# EAGLE schematic 426-300-001 Main Power Enclosure (EAGLE 6.5.0)

## Sheet 1 of 2
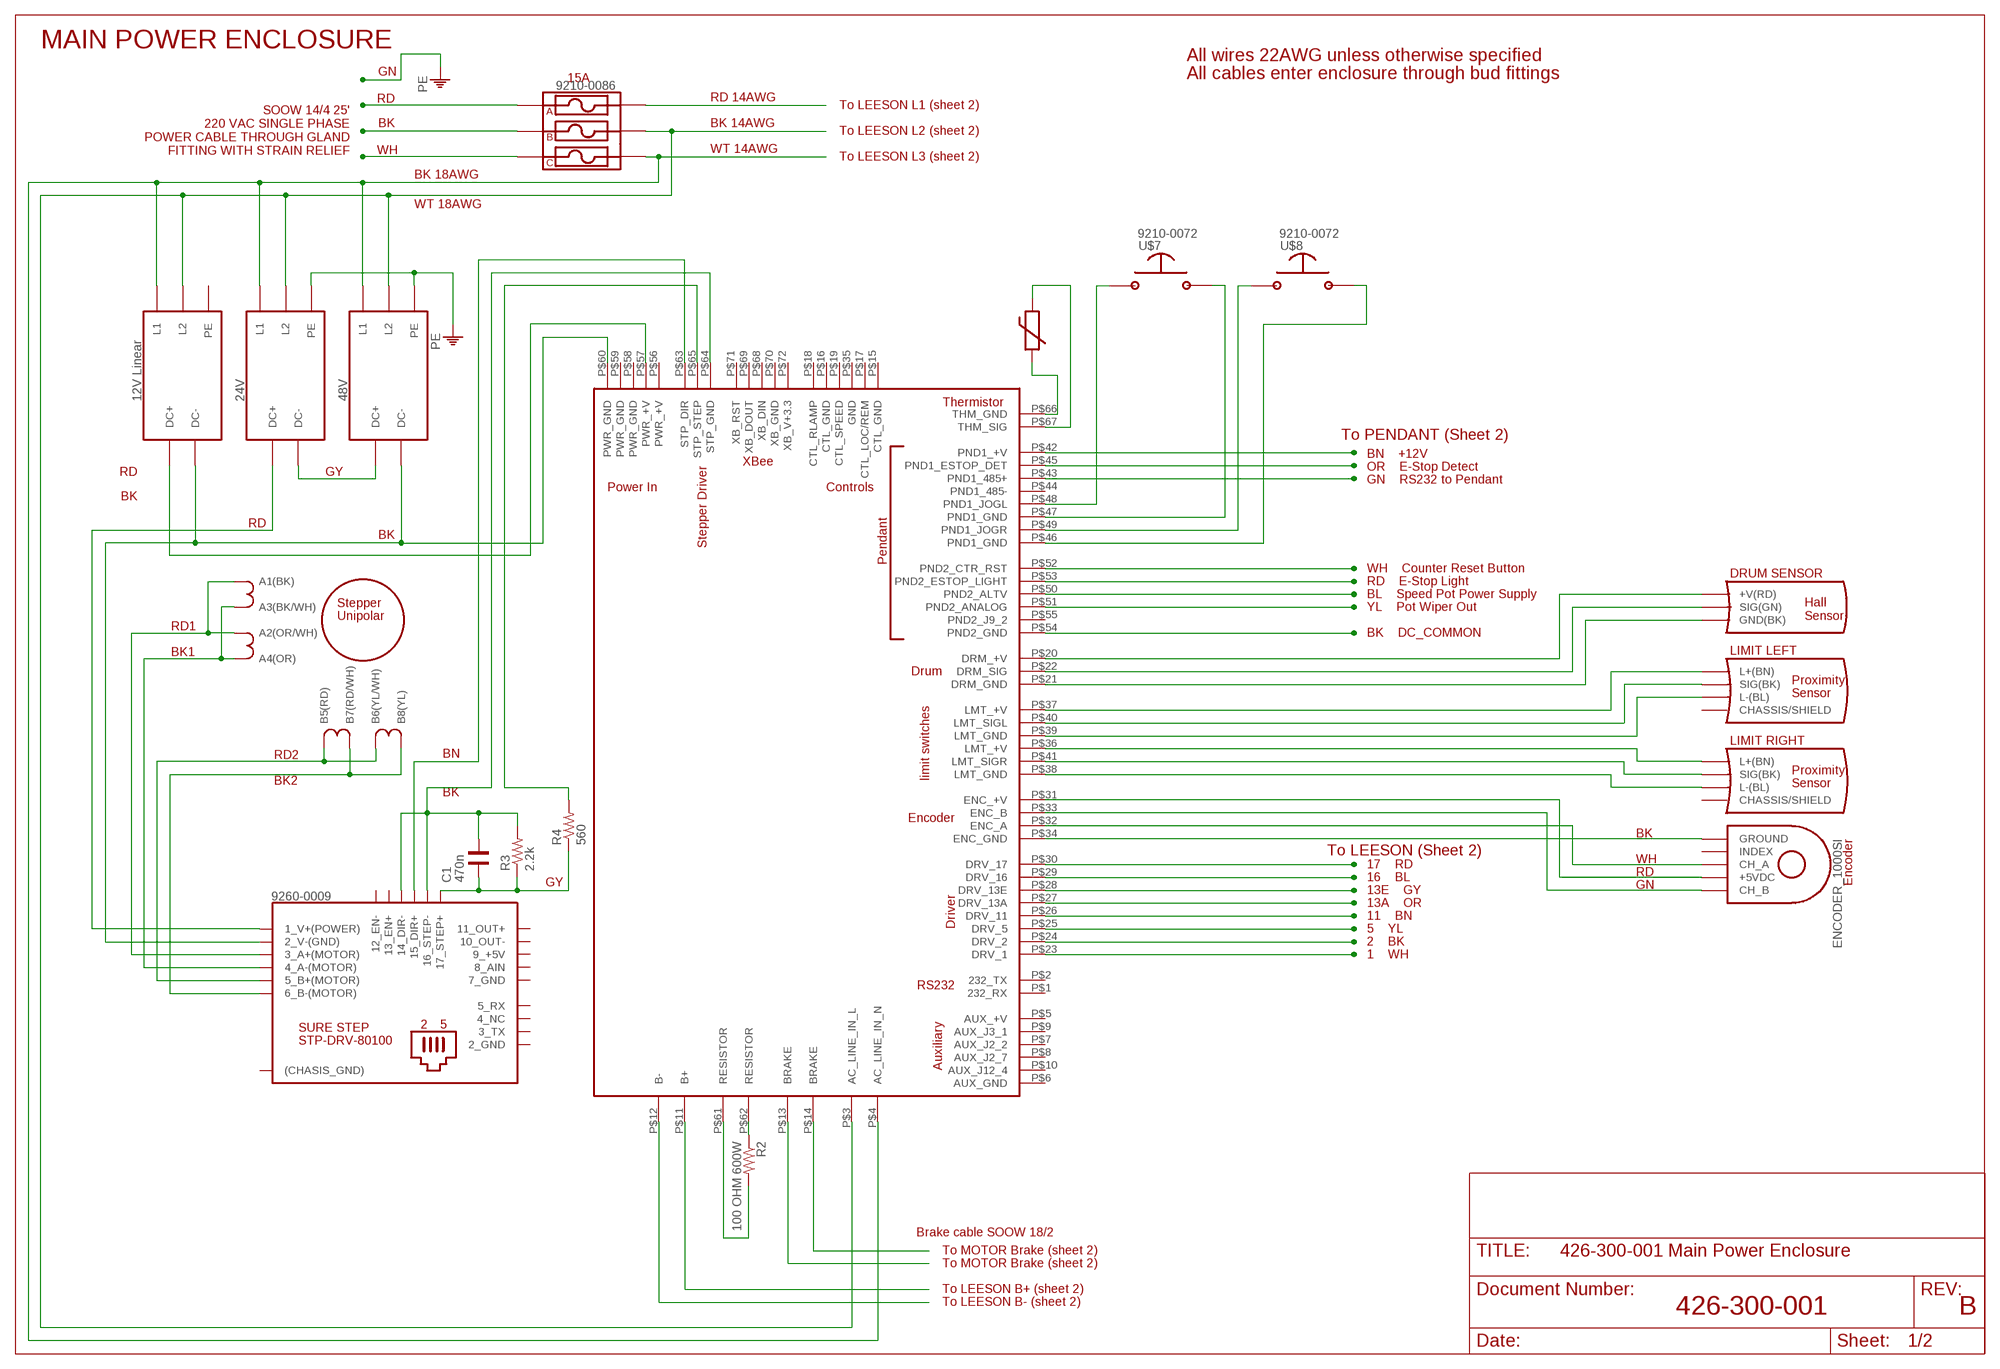
[diagram p0: schematic, sheet 1]

### Parts
C1  470n  C0805  [C0805]
R2  100 OHM 600W  RESISTORKIT  [AXIAL-0.3-KIT]
R3  2.2k  RESISTOR0805-RES  [0805]
R4  560  RESISTOR0805-RES  [0805]
U$2  THERMISTOR  [BOGUS]
U$3  SENSOR_HALL  [BOGUS@1]
U$4  ENCODER_1000SI  [BOGUS]
U$6  SENSOR_PROXIMITY  [BOGUS]
U$7  SWITCH_MOM_NO  [BOGUS]
U$8  SWITCH_MOM_NO  [BOGUS]
U$9  SENSOR_PROXIMITY  [BOGUS]
U$10  24V  POWER_SUPPLY  [BOGUS]
U$11  FUSE_HOLDER_3-POLE  [BOGUS]
U$12  48V  POWER_SUPPLY  [BOGUS]
U$13  MOTOR_STEPPER_UNIPOLAR  [BOGUS]
U$14  SURE_STEP_STP-DRV-80100  [BOGUS]
U$18  12V Linear  POWER_SUPPLY  [BOGUS]
U$19  SOSI_CONTROLLER_ECO_0.3  [BOGUS]

### Nets
N$1: U$11.P$3
N$2: U$9.P$3(L-(BL)) U$19.P$38(LMT_GND)
N$3: U$11.P$2
N$4: U$11.P$1
N$5: U$19.P$42(PND1_+V)
N$6: U$9.P$4(SIG(BK)) U$19.P$41(LMT_SIGR)
N$7: U$9.P$2(L+(BN)) U$19.P$36(LMT_+V)
N$8: U$19.P$45(PND1_ESTOP_DET)
N$9: U$7.P$1 U$19.P$48(PND1_JOGL)
N$10: U$7.P$2 U$19.P$47(PND1_GND)
N$11: U$8.P$1 U$19.P$49(PND1_JOGR)
N$12: U$6.P$2(L+(BN)) U$19.P$37(LMT_+V)
N$13: U$6.P$4(SIG(BK)) U$19.P$40(LMT_SIGL)
N$14: U$6.P$3(L-(BL)) U$19.P$39(LMT_GND)
N$15: U$8.P$2 U$19.P$46(PND1_GND)
N$16: U$10.P$4(L2) U$11.P$4 U$12.P$4(L2) U$18.P$4(L2) U$19.P$3(AC_LINE_IN_L)
N$17: U$19.P$52(PND2_CTR_RST)
N$18: R2.P$2 U$19.P$61(RESISTOR)
N$19: U$19.P$53(PND2_ESTOP_LIGHT)
N$20: U$2.P$1 U$19.P$66(THM_GND)
N$21: U$19.P$50(PND2_ALTV)
N$22: U$19.P$51(PND2_ANALOG)
N$23: U$19.P$54(PND2_GND)
N$24: U$10.P$3(L1) U$11.P$6 U$12.P$3(L1) U$18.P$3(L1) U$19.P$4(AC_LINE_IN_N)
N$25: U$19.P$43(PND1_485+)
N$26: U$19.P$23(DRV_1)
N$27: U$19.P$30(DRV_17)
N$32: U$19.P$24(DRV_2)
N$34: U$3.P$1(+V(RD)) U$19.P$20(DRM_+V)
N$35: U$3.P$3(SIG(GN)) U$19.P$22(DRM_SIG)
N$36: R2.P$1
N$37: U$3.P$2(GND(BK)) U$19.P$21(DRM_GND)
N$38: U$19.P$25(DRV_5)
N$39: U$2.P$2 U$19.P$67(THM_SIG)
N$40: U$4.P$1(+5VDC) U$19.P$31(ENC_+V)
N$41: U$4.P$3(CH_B) U$19.P$33(ENC_B)
N$42: U$4.P$2(CH_A) U$19.P$32(ENC_A)
N$43: U$4.P$4(GROUND) U$19.P$34(ENC_GND)
N$44: U$19.P$26(DRV_11)
N$46: U$19.P$27(DRV_13A)
N$48: U$19.P$28(DRV_13E)
N$49: U$19.P$29(DRV_16)
N$53: U$11.P$5
N$54: U$18.P$1(DC+) U$19.P$57(PWR_+V)
N$55: U$12.P$2(DC-) U$14.P$3(2_V-(GND)) U$18.P$2(DC-) U$19.P$60(PWR_GND)
N$59: C1.2 R3.2 U$14.P$15(14_DIR-) U$14.P$17(16_STEP-) U$19.P$64(STP_GND)
N$60: C1.1 R3.1 R4.1 U$14.P$18(17_STEP+)
N$61: U$14.P$16(15_DIR+) U$19.P$63(STP_DIR)
N$64: U$13.P$3(A3(BK/WH)) U$13.P$4(A4(OR)) U$14.P$5(4_A-(MOTOR))
N$65: U$13.P$1(A1(BK)) U$13.P$2(A2(OR/WH)) U$14.P$4(3_A+(MOTOR))
N$66: U$10.P$1(DC+) U$14.P$2(1_V+(POWER))
N$68: U$10.P$2(DC-) U$12.P$1(DC+)
N$69: U$13.P$5(B5(RD)) U$13.P$6(B6(YL/WH)) U$14.P$6(5_B+(MOTOR))
N$70: U$13.P$7(B7(RD/WH)) U$13.P$8(B8(YL)) U$14.P$7(6_B-(MOTOR))
N$76: R4.2 U$19.P$65(STP_STEP)
N$95: U$19.P$12(B-)
N$96: U$19.P$11(B+)
N$97: U$19.P$13(BRAKE)
N$98: U$19.P$14(BRAKE)
PE: U$10.P$5(PE) U$12.P$5(PE) ; also sheet 2
Unconnected: U$4.P$5(INDEX) U$6.P$1(CHASSIS/SHIELD) U$9.P$1(CHASSIS/SHIELD) U$18.P$5(PE) U$19.P$1(232_RX) U$19.P$2(232_TX) U$19.P$5(AUX_+V) U$19.P$6(AUX_GND) U$19.P$7(AUX_J2_2) U$19.P$8(AUX_J2_7) U$19.P$9(AUX_J3_1) U$19.P$10(AUX_J12_4) U$19.P$15(CTL_GND) U$19.P$16(CTL_GND) U$19.P$17(CTL_LOC/REM) U$19.P$18(CTL_RLAMP) U$19.P$19(CTL_SPEED) U$19.P$35(GND) U$19.P$44(PND1_485-) U$19.P$55(PND2_J9_2) U$19.P$56(PWR_+V) U$19.P$58(PWR_GND) U$19.P$59(PWR_GND) U$19.P$62(RESISTOR) U$19.P$68(XB_DIN) U$19.P$69(XB_DOUT) U$19.P$70(XB_GND) U$19.P$71(XB_RST) U$19.P$72(XB_V+3.3)

### Notes on the sheet
- MAIN POWER ENCLOSURE
- All wires 22AWG unless otherwise specified
- GN
- 15A | All cables enter enclosure through bud fittings
- RD | RD 14AWG
- SOOW 14/4 25'
  220 VAC SINGLE PHASE
  POWER CABLE THROUGH GLAND
  FITTING WITH STRAIN RELIEF
- To LEESON L1 (sheet 2)
- BK | BK 14AWG
- To LEESON L2 (sheet 2)
- WH | WT 14AWG
- To LEESON L3 (sheet 2)
- BK 18AWG
- WT 18AWG
- To PENDANT (Sheet 2)
- BN    +12V
- OR    E-Stop Detect
- RD | GY
- GN    RS232 to Pendant
- BK
- RD
- BK
- WH    Counter Reset Button
- DRUM SENSOR
- RD    E-Stop Light
- BL    Speed Pot Power Supply
- YL    Pot Wiper Out
- RD1
- BK    DC_COMMON
- BK1 | LIMIT LEFT
- LIMIT RIGHT
- RD2 | BN
- BK2
- BK
- BK
- To LEESON (Sheet 2)
- WH
- 17    RD
- RD
- 16    BL
- GY | GN
- 13E    GY
- 13A    OR
- 11    BN
- 5    YL
- 2    BK
- 1    WH
- Brake cable SOOW 18/2
- To MOTOR Brake (sheet 2)
- To MOTOR Brake (sheet 2)
- To LEESON B+ (sheet 2)
- To LEESON B- (sheet 2)
- 426-300-001 | B

## Sheet 2 of 2
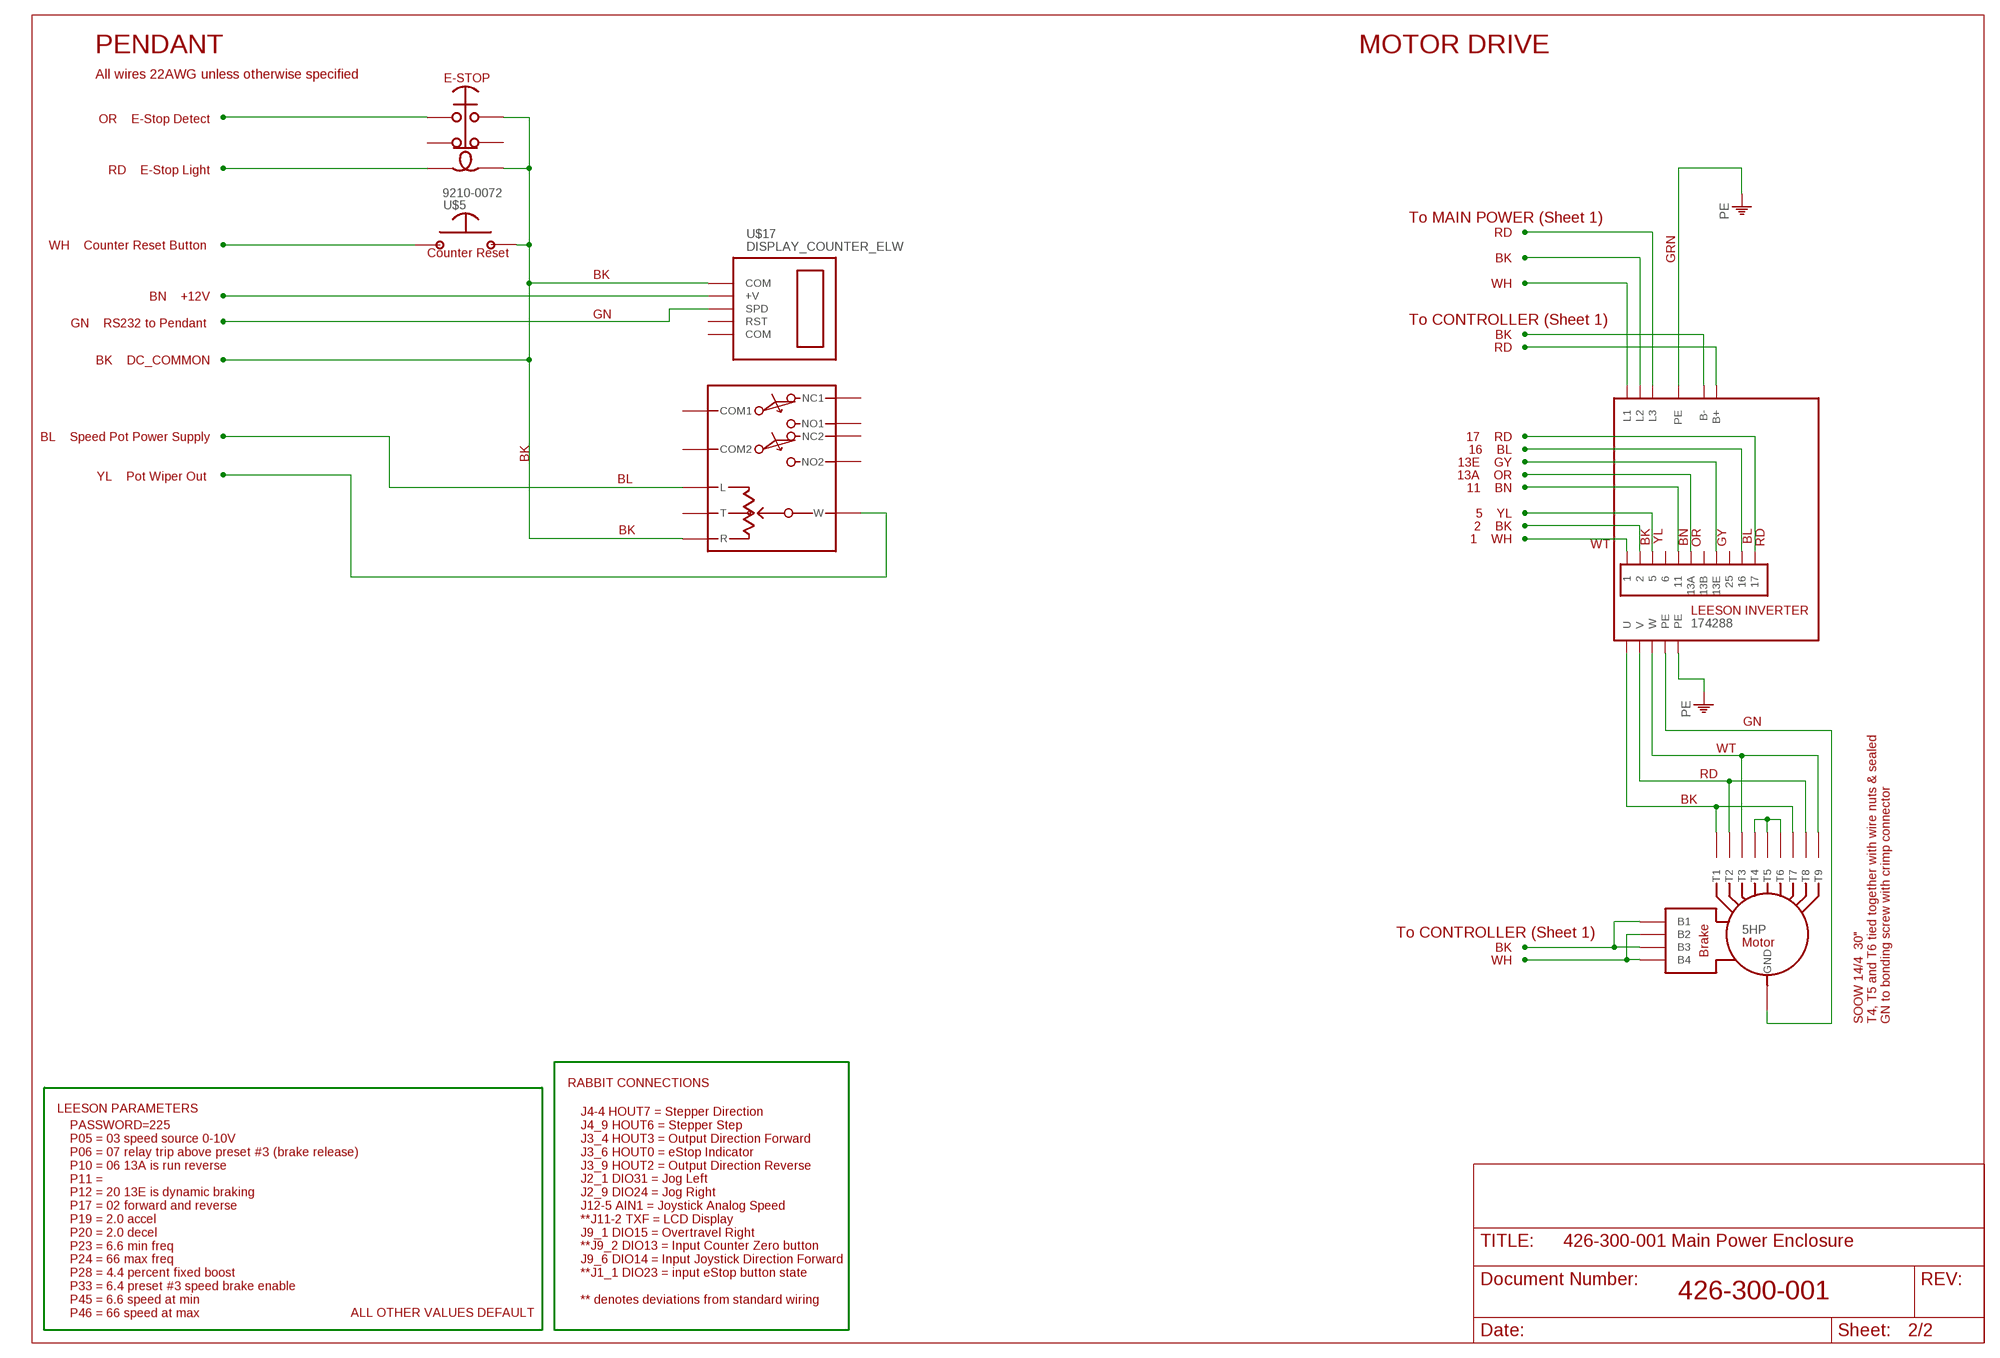
[diagram p1: schematic, sheet 2]

### Parts
U$1  5HP  MOTOR_3PH  [BOGUS]
U$5  Counter Reset  SWITCH_MOM_NO  [BOGUS]
U$15  SWITCH_ESTOP_LIGHTED  [BOGUS]
U$16  JOYSTICK_PRO-5  [BOGUS]
U$17  DISPLAY_COUNTER_ELW  [BOGUS]
U$24  174288  INVERTER_LEESON_3-PHASE  [BOGUS@2]

### Nets
N$28: U$17.P$5(SPD)
N$29: U$5.P$1
N$30: U$15.P$1
N$31: U$16.P$3(L)
N$33: U$5.P$2 U$15.P$3 U$15.P$6 U$16.P$8(R) U$17.P$2(COM)
N$45: U$24.P$14(L1)
N$47: U$1.P$8(T4) U$1.P$9(T5) U$1.P$10(T6)
N$58: U$1.P$5(T1) U$1.P$11(T7) U$24.P$20(U)
N$63: U$15.P$5
N$71: U$1.P$6(T2) U$1.P$12(T8) U$24.P$21(V)
N$72: U$1.P$7(T3) U$1.P$13(T9) U$24.P$22(W)
N$73: U$16.P$10(W)
N$74: U$1.P$14(GND) U$24.P$18(PE)
N$75: U$17.P$1(+V)
N$77: U$1.P$2(B2) U$1.P$4(B4)
N$80: U$24.P$15(L2)
N$81: U$24.P$1
N$82: U$1.P$1(B1) U$1.P$3(B3)
N$83: U$24.P$2
N$84: U$24.P$3
N$85: U$24.P$5
N$86: U$24.P$6(13A)
N$87: U$24.P$16(L3)
N$88: U$24.P$13(B-)
N$89: U$24.P$12(B+)
N$90: U$24.P$9
N$91: U$24.P$8(13E)
N$92: U$24.P$10
PE: U$24.P$17(PE) U$24.P$19(PE) ; also sheet 1
Unconnected: U$15.P$2 U$15.P$4 U$16.P$1(COM1) U$16.P$2(COM2) U$16.P$4(NC1) U$16.P$5(NC2) U$16.P$6(NO1) U$16.P$7(NO2) U$16.P$9(T) U$17.P$3(COM) U$17.P$4(RST) U$24.P$4 U$24.P$7(13B) U$24.P$11

### Notes on the sheet
- PENDANT | MOTOR DRIVE
- All wires 22AWG unless otherwise specified
- OR    E-Stop Detect
- RD    E-Stop Light
- To MAIN POWER (Sheet 1)
- RD
- WH    Counter Reset Button
- BK
- Counter Reset
- GRN
- BK | WH
- BN    +12V
- GN    RS232 to Pendant | GN
- To CONTROLLER (Sheet 1)
- BK
- RD
- BK    DC_COMMON
- BL    Speed Pot Power Supply | 17    RD
- 16    BL
- 13E    GY
- BK
- YL    Pot Wiper Out | 13A    OR
- BL | 11    BN
- 5    YL
- 2    BK
- BK | YL | BN | OR | GY | BL | RD
- BK | 1    WH
- WT
- GN
- WT
- RD
- BK
- To CONTROLLER (Sheet 1)
- BK
- WH
- SOOW 14/4  30"
  T4, T5 and T6 tied together with wire nuts & sealed
  GN to bonding screw with crimp connector
- RABBIT CONNECTIONS
- LEESON PARAMETERS
- 426-300-001
- PASSWORD=225
  P05 = 03 speed source 0-10V
  P06 = 07 relay trip above preset #3 (brake release)
  P10 = 06 13A is run reverse
  P11 =
  P12 = 20 13E is dynamic braking
  P17 = 02 forward and reverse
  P19 = 2.0 accel
  P20 = 2.0 decel
  P23 = 6.6 min freq
  P24 = 66 max freq
  P28 = 4.4 percent fixed boost
  P33 = 6.4 preset #3 speed brake enable
  P45 = 6.6 speed at min
  P46 = 66 speed at max
- ALL OTHER VALUES DEFAULT
- J4-4 HOUT7 = Stepper Direction
  J4_9 HOUT6 = Stepper Step
  J3_4 HOUT3 = Output Direction Forward
  J3_6 HOUT0 = eStop Indicator
  J3_9 HOUT2 = Output Direction Reverse
  J2_1 DIO31 = Jog Left
  J2_9 DIO24 = Jog Right
  J12-5 AIN1 = Joystick Analog Speed
  **J11-2 TXF = LCD Display
  J9_1 DIO15 = Overtravel Right
  **J9_2 DIO13 = Input Counter Zero button
  J9_6 DIO14 = Input Joystick Direction Forward
  **J1_1 DIO23 = input eStop button state
  
  ** denotes deviations from standard wiring

## Power pins joined to a net without a drawn wire
2_GND: U$14.P$19(2_GND)
3_TX: U$14.P$20(3_TX)
4_NC: U$14.P$21(4_NC)
5_RX: U$14.P$22(5_RX)
7_GND: U$14.P$8(7_GND)
8_AIN: U$14.P$9(8_AIN)
9_+5V: U$14.P$10(9_+5V)
10_OUT-: U$14.P$11(10_OUT-)
11_OUT+: U$14.P$12(11_OUT+)
12_EN-: U$14.P$13(12_EN-)
13_EN+: U$14.P$14(13_EN+)
(CHASIS_GND): U$14.P$1((CHASIS_GND))

## Library data of the parts
C1 = DougM-SOSI-ResCap:C0805: chicklet part - capacitor 0805
R2-R4 = DougM-SOSI-ResCap:RESISTOR: Resistor Basic schematic elements and footprints for 0603, 1206, and PTH resistors.
U$1 = DougM-SOSI-Wiring-Diagram:MOTOR_3PH: 9500-0000 113020 Electric motor, washdown, 1HP, 208-230/460VAC, 3 phase, 1725 RPM, 56C mounting 9500-0005 G120762 Electric Motor, Washdown, 2HP, 208-230/460V, 60Hz, Cont., 1800 RPM, TEFC, 145TC 9500-0007 CEWDBM3611T BrakeMotor, Electric, Washdown, 3HP, 208-230/460V, 1760RPM, 3 Ph., 60Hz, 182TC, TEFC 9500-0009 G140467.00 Electric Motor, Washdown, 7.5HP, 220 VAC, 50-60 Hz, 3 Phase, 213TC Frame, No Base Leeson Kaman Industrial Technologies McGuire Bearing
U$2 = DougM-SOSI-Wiring-Diagram.rpt:THERMISTOR: (no PN available) (no description available) Soundnine Inc. (no vendor PN available)
U$3 = DougM-SOSI-Wiring-Diagram.rpt:SENSOR_HALL
U$4 = DougM-SOSI-Wiring-Diagram.rpt:ENCODER_1000SI: (no PN) 1000SI Single-Ended Encoder with Index Channel (comes as part of Stepper Motor assembly 9500-0016) Anaheim Automation
U$5 = DougM-SOSI-Wiring-Diagram:SWITCH_MOM_NO: 9210-0072 Mouser Part #: 850-59-313 Manufacturer Part #: 59-313
U$6 U$9 = DougM-SOSI-Wiring-Diagram.rpt:SENSOR_PROXIMITY: 9210-0023 Proximity Sensor, Inductive, 5mm Dia., 10-30 VDC, 3-wire, NPN, Shielded, 1.5mm nominal sensing distance, N.O., 2-meter cable 9210-0088 Proximity Sensor, Inductive, 12mm Dia., 10-30 VDC, 3-wire, unshielded, 8mm nominal sensing distance, N.O., 2-meter cable 9210-0191 Proximity Sensor, Inductive, 8mm Dia., extended range, 10-30 VDC, 3-wire, NPN, N.O., 4mm nominal sensing distance, unshielded 2-meter cable 9210-0284 Sensor, Proximity, Inductive, 18mm Dia., Extended Range, 10-30 VDC, 3 Wire, NPN, shielded, 2-Meter Cable Manufacturer Automation Direct
U$7 U$8 = DougM-SOSI-Wiring-Diagram.rpt:SWITCH_MOM_NO: 9210-0072 Mouser Part #: 850-59-313 Manufacturer Part #: 59-313
U$10 U$12 U$18 = DougM-SOSI-Wiring-Diagram.rpt:POWER_SUPPLY: 9210-0283 VGD-60-D524 Power Supply, VGD Series, AC/DC Convert Dual, 5/24V 60W, ENC 9260-0010 HRPG-200-48 Power Supply, 48VDC, 200W Single Output w/ PFC Function 9260-0011 USP-500-48 48VDC 500 Watt Power Supply 9260-0019 HC24-2.4-AG Linear Power Supply, 24V, 2.4A Output 9260-0020 HRPG-200-24 Power Supply, Linear & Switching, 24VDC, 201.6W, 8.4A, w/ PFC 9350-0002 UTC-3124 Signal Conditioner and Power Supply
U$11 = DougM-SOSI-Wiring-Diagram.rpt:FUSE_HOLDER_3-POLE: 9210-0086 BC6033PQ Fuseholder, Class CC & Class G, 3 pole, 600V, 30A, for 13/32x1 1/2 fuses Cooper/Bussman North Coast Electric
U$13 = DougM-SOSI-Wiring-Diagram.rpt:MOTOR_STEPPER_UNIPOLAR: 9500-0016 34Y214D-LW8-1000SI Stepper Motor with 1000 line encoder Anaheim Automation Kaman Industrial Technologies
U$14 = DougM-SOSI-Wiring-Diagram.rpt:SURE_STEP_STP-DRV-80100: 9260-0009 STP-DRV-80100 Step Motor Driver, 80 V 10A Sure Step Automation Direct
U$15 = DougM-SOSI-Wiring-Diagram:SWITCH_ESTOP_LIGHTED: 9210-0045 Switch, Emergency Stop, w/ #800T-XA4 contact block (old #800H-FRXTQH10RA4) Allen Bradley 800H-FRXTQH2RA4
U$16 = DougM-SOSI-Wiring-Diagram:JOYSTICK_PRO-5: 9280-0000 PRO5-202.1085 (w/20k center tap potentiometer) Joystick (Master Switch), w/20k center tap potentiometer J. R. Merritt Controls
U$17 = DougM-SOSI-Wiring-Diagram:DISPLAY_COUNTER_ELW: 9215-0003 12062A-1 Display Board Assy., ECO-ELW line speed/counter Soundnine Inc.
U$19 = DougM-SOSI-Wiring-Diagram.rpt:SOSI_CONTROLLER_ECO_0.3: 418-300-004 ECO Controller 0.3 Sound Ocean Systems 418-300-004 Sound Ocean Systems 418-300-004
U$24 = DougM-SOSI-Wiring-Diagram.rpt:INVERTER_LEESON_3-PHASE: 9260-0001 174265 Motor control, adjustable speed, 1HP, 110VAC single phase input, 220VAC 3 phase output 9260-0002 174270 Motor control, adjustable speed, 1HP, 220VAC single phase input, 220VAC 3 phase output 9260-0006 174278 Inverter, SM Series, 2HP, 208/240 VAC, 3-Phase 9260-0007 174279 Inverter, SM Series, 3HP, 208/240 VAC, 3-Phase 9260-0008 174280 Inverter, SM Series, 7.5HP, 208/240 VAC, 3-Phase 9260-0016 174432 Inverter, SM Series, 20HP, 400-480V, 3-Phase 9260-0017 174282 Inverter, SM Series, 1HP, 400-480V, 3-Phase 9260-0021 174273 Inverter, SM Series, 3HP, 208/240 VAC, 1 phase 9260-0022 174272 Inverter, SM Series, 2HP, 208/240 VAC, 1 phase Leeson Allied Electronics McGuire Bearing